# Altium schematic sheet MCU.SchDoc
size A4; SheetNumber: 2; SheetTotal: 4; SPICEModelCacheKZCSYQUI: <root> / <DocumentId>KZCSYQUI</DocumentId> / </root>
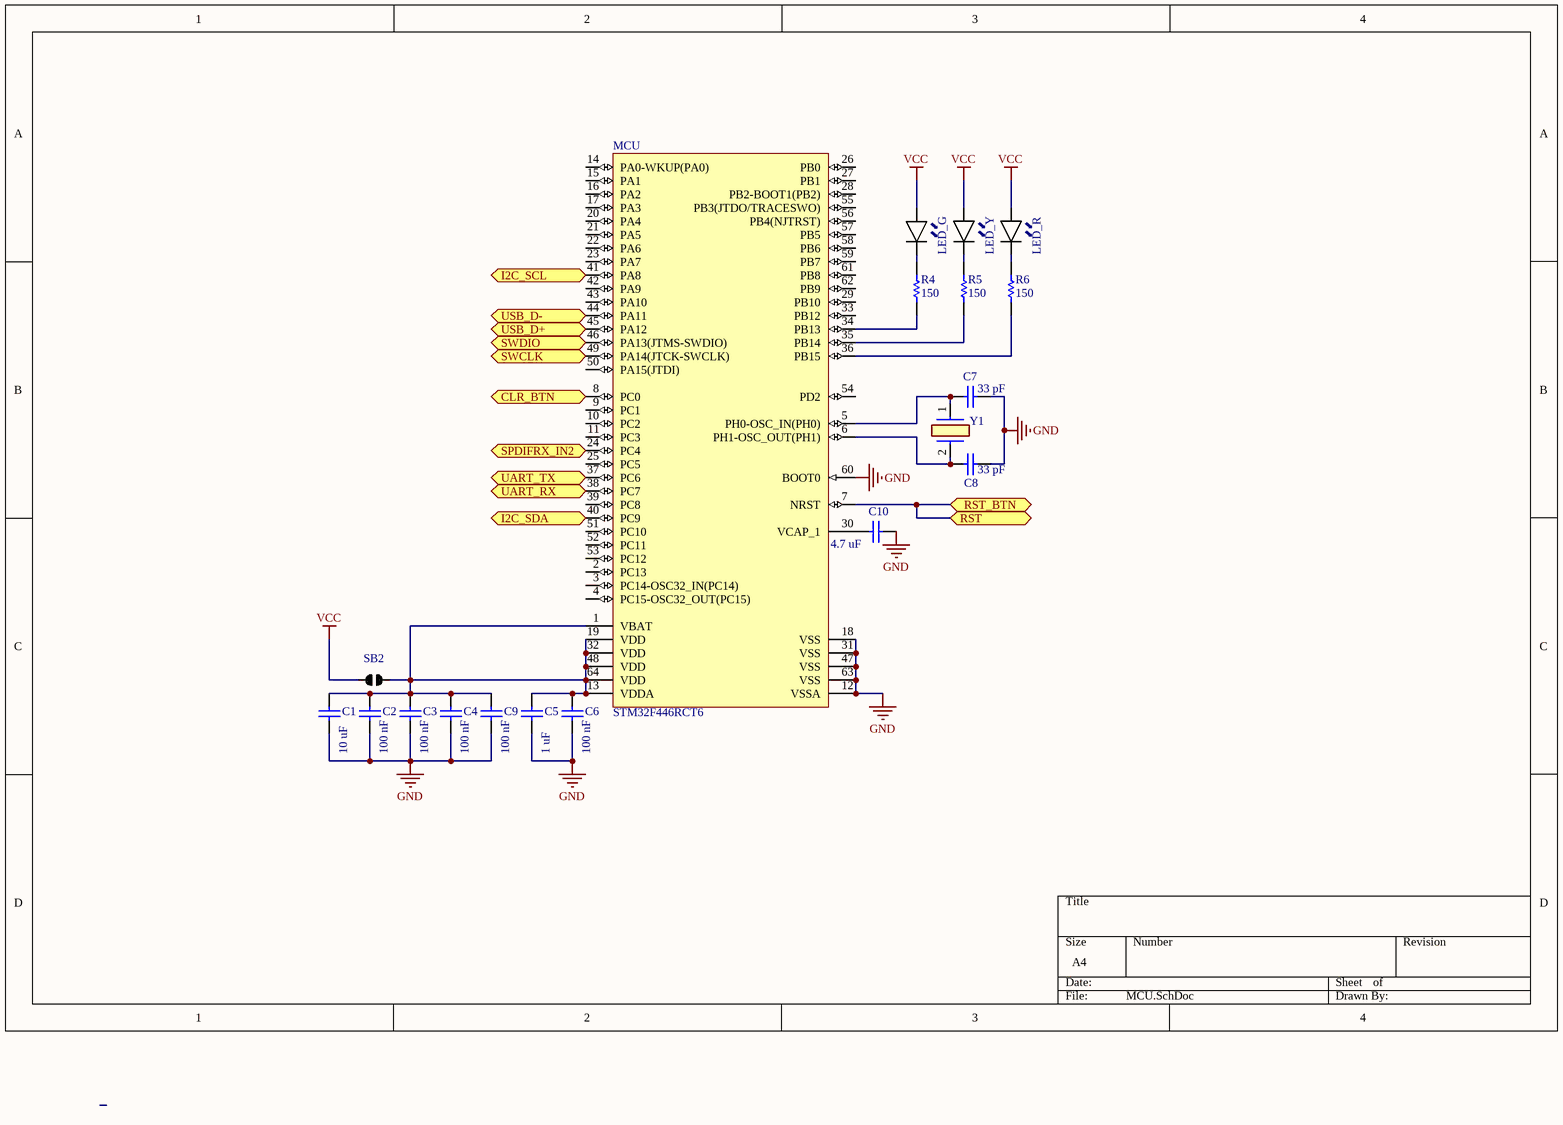
[diagram p0: MCU.SchDoc]

## Parts
C1  value 10 uF  [J1-0603]  (hidden comment: C19702)
C2  value 100 nF  [0402]  (hidden comment: C1525)
C3  value 100 nF  [0402]  (hidden comment: C1525)
C4  value 100 nF  [0402]  (hidden comment: C1525)
C5  value 1 uF  [J1-0603]  (hidden comment: C15849)
C6  value 100 nF  [0402]  (hidden comment: C1525)
C7  value 33 pF  [0402]  (hidden comment: C1562)
C8  value 33 pF  [0402]  (hidden comment: C1562)
C9  value 100 nF  [0402]  (hidden comment: C1525)
C10  value 4.7 uF  [J1-0603]  (hidden comment: C19666)
LED_G  fucking led maat hoe moeilijk ist kutprogram  [LED_SSL-LX4673GD-LA20]  (value not drawn)
LED_R  fucking led maat hoe moeilijk ist kutprogram  [LED_SSL-LX4673GD-LA20]  (value not drawn)
LED_Y  fucking led maat hoe moeilijk ist kutprogram  [LED_SSL-LX4673GD-LA20]  (value not drawn)
MCU  STM32F446RCT6  [STM-LQFP64_L]
R4  value 150  [J1-0603]  (hidden comment: C22808)
R5  value 150  [J1-0603]  (hidden comment: C22808)
R6  value 150  [J1-0603]  (hidden comment: C22808)
SB2  Solder Bridge  [Solder Bridge]  (value not drawn)
Y1  X50328MSB2GI  [RESC5032X135N]  (value not drawn)

## Ports
CLR_BTN (bidir, see Top[3A], Connectivity[3B]), I2C_SCL (bidir, see Top[3A], Connectivity[3C]), I2C_SDA (bidir, see Top[3A], Connectivity[3C]), RST (bidir, see Top[3B], Connectivity[3C]), RST_BTN (bidir, see Top[3B], Connectivity[2B]), SPDIFRX_IN2 (bidir, see Top[3B], Connectivity[3A]), SWCLK (bidir, see Top[3B], Connectivity[3C]), SWDIO (bidir, see Top[3B], Connectivity[3C]), UART_RX (bidir, see Top[3B], Connectivity[3C]), UART_TX (bidir, see Top[3B], Connectivity[3C]), USB_D+ (bidir, see Top[3B], Connectivity[2C]), USB_D- (bidir, see Top[3B], Connectivity[2C])

## Nets
GND: C1.1 C2.1 C3.1 C4.1 C5.1 C6.1 C7.2 C8.2 C9.1 C10.2 MCU.12(VSSA) MCU.18(VSS) MCU.31(VSS) MCU.47(VSS) MCU.60(BOOT0) MCU.63(VSS)
VCC: LED_G.2 LED_R.2 LED_Y.2 SB2.1
CLR_BTN: MCU.8(PC0) ; port CLR_BTN
I2C_SCL: MCU.41(PA8) ; port I2C_SCL
I2C_SDA: MCU.40(PC9) ; port I2C_SDA
RST: MCU.7(NRST) ; port RST_BTN, port RST
SPDIFRX_IN2: MCU.24(PC4) ; port SPDIFRX_IN2
SWCLK: MCU.49(PA14(JTCK-SWCLK)) ; port SWCLK
SWDIO: MCU.46(PA13(JTMS-SWDIO)) ; port SWDIO
UART_RX: MCU.38(PC7) ; port UART_RX
UART_TX: MCU.37(PC6) ; port UART_TX
USB_D+: MCU.45(PA12) ; port USB_D+
USB_D-: MCU.44(PA11) ; port USB_D-
NetC1_2: C1.2 C2.2 C3.2 C4.2 C5.2 C6.2 C9.2 MCU.1(VBAT) MCU.13(VDDA) MCU.19(VDD) MCU.32(VDD) MCU.48(VDD) MCU.64(VDD) SB2.2
NetC7_1: C7.1 MCU.5(PH0-OSC_IN(PH0)) Y1.1
NetC8_1: C8.1 MCU.6(PH1-OSC_OUT(PH1)) Y1.2
NetC10_1: C10.1 MCU.30(VCAP_1)
NetLED_G_1: LED_G.1 R4.1
NetLED_R_1: LED_R.1 R6.1
NetLED_Y_1: LED_Y.1 R5.1
NetMCU_34: MCU.34(PB13) R4.2
NetMCU_35: MCU.35(PB14) R5.2
NetMCU_36: MCU.36(PB15) R6.2

Not connected (* = marked no-connect by the designer): MCU 2(PC13) 3(PC14-OSC32_IN(PC14)) 4(PC15-OSC32_OUT(PC15)) 9(PC1) 10(PC2) 11(PC3) 14(PA0-WKUP(PA0)) 15(PA1) 16(PA2) 17(PA3) 20(PA4) 21(PA5) 22(PA6) 23(PA7) 25(PC5) 26(PB0) 27(PB1) 28(PB2-BOOT1(PB2)) 29(PB10) 33(PB12) 39(PC8) 42(PA9) 43(PA10) 50(PA15(JTDI)) 51(PC10) 52(PC11) 53(PC12) 54(PD2) 55(PB3(JTDO/TRACESWO)) 56(PB4(NJTRST)) 57(PB5) 58(PB6) 59(PB7) 61(PB8) 62(PB9)

## Notes on the sheet
- (in symbol fucking led maat hoe moeilijk ist kutprogram) ⬈⬈

## Library data of the parts
C1-C10 = Cap: Capacitor; Published: 8-Jun-2000; LatestRevisionDate: 17-Jul-2002; LatestRevisionNote: Re-released for DXP Platform.; PackageReference: RAD-0.3; Publisher: Altium Limited; PackageDescription: Radial Cap, Thru-Hole; 2 Leads; 0.3 in Pin Spacing
LED_G LED_R LED_Y = fucking led maat hoe moeilijk ist kutprogram: DNP
MCU = CMP-0243-00216-1: ARM Cortex-M4 32-bit MCU+FPU, 256 KB Flash, 128 KB Internal RAM, 50 I/Os, 64-Pin LQFP, -40 to 85 degC, Tray; Operating Frequency(F) (Processor speed) (MHz): 180; Internal RAM Size (kB): 128; I/Os (High Current): 50; FLASH Size (Prog) (kB): 256; D/A Converter: 2; Supply Voltage(Vcc) min (V): 1.7; Mounting Technology: Surface Mount; DatasheetVersion: Rev. 6; ComponentLink1URL: http://www.st.com/; Package Description: LQFP64; ComponentLink1Description: Manufacturer URL; Packing: Tray; ComponentLink2Description: Datasheet; Core: ARM Cortex-M4; Package Reference: 64-Pin Low-profile Quad Flat Package, Body 10 x 10 mm, Pitch 0.5 mm; ComponentLink2URL: http://www.st.com/st-web-ui/static/active/en/resource/technical/document/datasheet/DM00141306.pdf
R4-R6 = Res1: Published: 8-Jun-2000; LatestRevisionDate: 17-Jul-2002; LatestRevisionNote: Re-released for DXP Platform.; PackageReference: AXIAL-0.3; Publisher: Altium Limited; PackageDescription: Axial Device, Thru-Hole; 2 Leads; 0.3 in Pin Spacing
SB2 = Solder Bridge: DNP
Y1 = X50328MSB2GI: C115962; Manufacturer_Name: Yangxing Tech; Datasheet Link: https://datasheet.lcsc.com/szlcsc/1903061615_Yangxing-Tech-X50328MSB2GI_C115962.pdf; Height: 1.35mm; Manufacturer_Part_Number: X50328MSB2GI